# Altium schematic sheet LazeMEGA.SchDoc
size A4
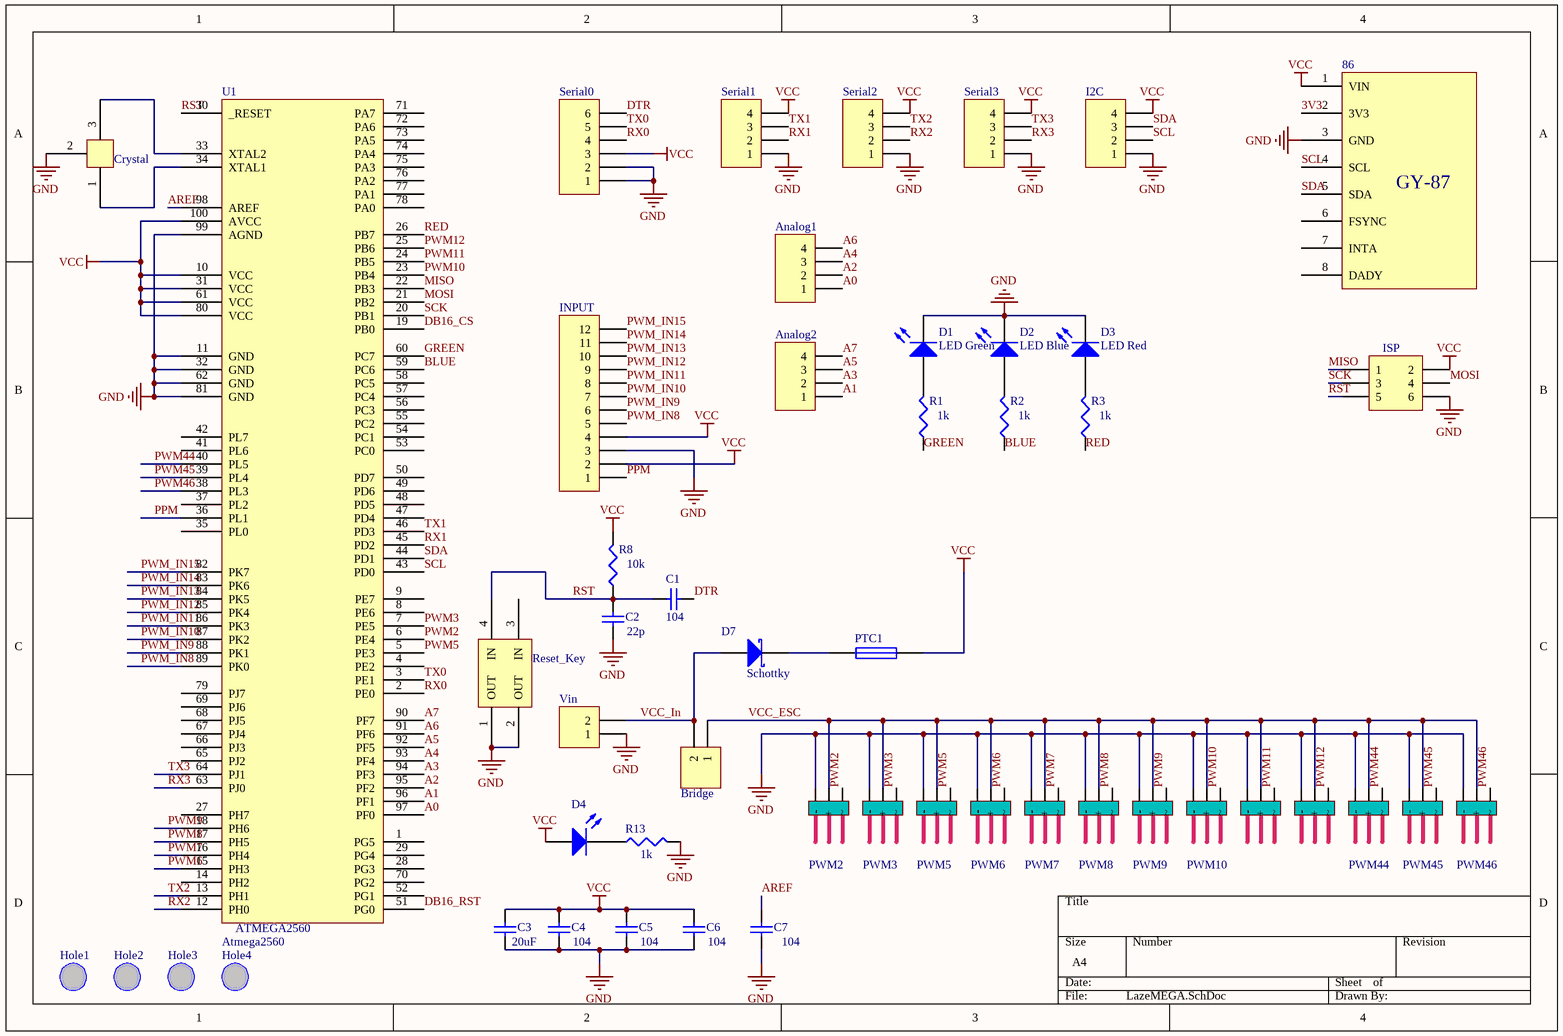
[diagram p0: LazeMEGA.SchDoc]

## Parts
86  (no value)  [GY-87]
Analog1  Header 4  [HDR1X4]  (value not drawn)
Analog2  Header 4  [HDR1X4]  (value not drawn)
Bridge  Header 2  [HDR1X2]  (value not drawn)
C1  104  [CAPC1608L]
C2  22p  [CAPC1608L]
C3  20uF  [CAPC3216L]
C4  104  [CAPC1608L]
C5  104  [CAPC1608L]
C6  104  [CAPC1608L]
C7  104  [CAPC1608L]
Crystal  Crystal 16M  [Crystal3Foot]  (value not drawn)
D1  LED Green  [CAPC2012L]
D2  LED Blue  [CAPC2012L]
D3  LED Red  [CAPC2012L]
D4  LED Red  [CAPC2012L]  (value not drawn)
D7  Schottky  [CAPC3216L]
Hole1  3mmHole  [3mmHoleSmall]  (value not drawn)
Hole2  3mmHole  [3mmHoleSmall]  (value not drawn)
Hole3  3mmHole  [3mmHoleSmall]  (value not drawn)
Hole4  3mmHole  [3mmHoleSmall]  (value not drawn)
I2C  Header 4  [HDR1X4]  (value not drawn)
INPUT  Header 12  [HDR1X12]  (value not drawn)
ISP  Header 3X2  [HDR2X3]  (value not drawn)
JP1  Servo out 1  [JP]  (value not drawn)
JP2  Servo out 1  [JP]  (value not drawn)
PTC1  Fuse  [CAPC3216L]  (value not drawn)
PWM2  Servo out 1  [JP]  (value not drawn)
PWM3  Servo out 1  [JP]  (value not drawn)
PWM5  Servo out 1  [JP]  (value not drawn)
PWM6  Servo out 1  [JP]  (value not drawn)
PWM7  Servo out 1  [JP]  (value not drawn)
PWM8  Servo out 1  [JP]  (value not drawn)
PWM9  Servo out 1  [JP]  (value not drawn)
PWM10  Servo out 1  [JP]  (value not drawn)
PWM44  Servo out 1  [JP]  (value not drawn)
PWM45  Servo out 1  [JP]  (value not drawn)
PWM46  Servo out 1  [JP]  (value not drawn)
R1  1k  [RESC1608L]
R2  1k  [RESC1608L]
R3  1k  [RESC1608L]
R8  10k  [RESC1608L]
R13  1k  [RESC1608L]
Reset_Key  Key  [Key]  (value not drawn)
Serial0  Header 6  [HDR1X6]  (value not drawn)
Serial1  Header 4  [HDR1X4]  (value not drawn)
Serial2  Header 4  [HDR1X4]  (value not drawn)
Serial3  Header 4  [HDR1X4]  (value not drawn)
U1  Atmega2560  [ATMEGA2560]
Vin  Header 2  [HDR1X2]  (value not drawn)

## Nets
GND: 86.3(GND) C2.2 C3.1 C4.1 C5.1 C6.1 C7.1 Crystal.2 D1.2(K) D2.2(K) D3.2(K) I2C.1 INPUT.3 ISP.6 JP1.3(-) JP2.3(-) PWM2.3(-) PWM3.3(-) PWM5.3(-) PWM6.3(-) PWM7.3(-) PWM8.3(-) PWM9.3(-) PWM10.3(-) PWM44.3(-) PWM45.3(-) PWM46.3(-) R13.2 Reset_Key.1(OUT) Reset_Key.2(OUT) Serial0.1 Serial0.2 Serial1.1 Serial2.1 Serial3.1 U1.11(GND) U1.32(GND) U1.62(GND) U1.81(GND) U1.99(AGND) Vin.1
VCC: 86.1(VIN) C3.2 C4.2 C5.2 C6.2 D4.1(A) I2C.4 INPUT.2 INPUT.4 ISP.2 PTC1.2 R8.2 Serial0.3 Serial1.4 Serial2.4 Serial3.4 U1.10(VCC) U1.31(VCC) U1.61(VCC) U1.80(VCC) U1.100(AVCC)
3V3: 86.2(3V3)
A0: Analog1.1 U1.97(PF0)
A1: Analog2.1 U1.96(PF1)
A2: Analog1.2 U1.95(PF2)
A3: Analog2.2 U1.94(PF3)
A4: Analog1.3 U1.93(PF4)
A5: Analog2.3 U1.92(PF5)
A6: Analog1.4 U1.91(PF6)
A7: Analog2.4 U1.90(PF7)
AREF: C7.2 U1.98(AREF)
BLUE: R2.1 U1.59(PC6)
DB16_CS: U1.19(PB0)
DB16_RST: U1.51(PG0)
DTR: C1.2 Serial0.6
GREEN: R1.1 U1.60(PC7)
MISO: ISP.1 U1.22(PB3)
MOSI: ISP.4 U1.21(PB2)
PPM: INPUT.1 U1.36(PL1)
PWM2: PWM2.1 U1.6(PE4)
PWM3: PWM3.1 U1.7(PE5)
PWM5: PWM5.1 U1.5(PE3)
PWM6: PWM6.1 U1.15(PH3)
PWM7: PWM7.1 U1.16(PH4)
PWM8: PWM8.1 U1.17(PH5)
PWM9: PWM9.1 U1.18(PH6)
PWM10: PWM10.1 U1.23(PB4)
PWM11: JP1.1 U1.24(PB5)
PWM12: JP2.1 U1.25(PB6)
PWM44: PWM44.1 U1.40(PL5)
PWM45: PWM45.1 U1.39(PL4)
PWM46: PWM46.1 U1.38(PL3)
PWM_IN8: INPUT.5 U1.89(PK0)
PWM_IN9: INPUT.6 U1.88(PK1)
PWM_IN10: INPUT.7 U1.87(PK2)
PWM_IN11: INPUT.8 U1.86(PK3)
PWM_IN12: INPUT.9 U1.85(PK4)
PWM_IN13: INPUT.10 U1.84(PK5)
PWM_IN14: INPUT.11 U1.83(PK6)
PWM_IN15: INPUT.12 U1.82(PK7)
RED: R3.1 U1.26(PB7)
RST: C1.1 C2.1 ISP.5 R8.1 Reset_Key.4(IN) U1.30(_RESET)
RX0: Serial0.4 U1.2(PE0)
RX1: Serial1.2 U1.45(PD2)
RX2: Serial2.2 U1.12(PH0)
RX3: Serial3.2 U1.63(PJ0)
SCK: ISP.3 U1.20(PB1)
SCL: 86.4(SCL) I2C.2 U1.43(PD0)
SDA: 86.5(SDA) I2C.3 U1.44(PD1)
TX0: Serial0.5 U1.3(PE1)
TX1: Serial1.3 U1.46(PD3)
TX2: Serial2.3 U1.13(PH1)
TX3: Serial3.3 U1.64(PJ1)
VCC_ESC: Bridge.1 JP1.2(+) JP2.2(+) PWM2.2(+) PWM3.2(+) PWM5.2(+) PWM6.2(+) PWM7.2(+) PWM8.2(+) PWM9.2(+) PWM10.2(+) PWM44.2(+) PWM45.2(+) PWM46.2(+)
VCC_In: Bridge.2 D7.1(A) Vin.2
NetCrystal_1: Crystal.1 U1.34(XTAL1)
NetCrystal_3: Crystal.3 U1.33(XTAL2)
NetD1_1: D1.1(A) R1.2
NetD2_1: D2.1(A) R2.2
NetD3_1: D3.1(A) R3.2
NetD4_2: D4.2(K) R13.1
NetD7_2: D7.2(K) PTC1.1

Not connected (* = marked no-connect by the designer): 86 6(FSYNC) 7(INTA) 8(DADY); Reset_Key 3(IN); U1 1(PG5) 4(PE2) 8(PE6) 9(PE7) 14(PH2) 27(PH7) 28(PG3) 29(PG4) 35(PL0) 37(PL2) 41(PL6) 42(PL7) 47(PD4) 48(PD5) 49(PD6) 50(PD7) 52(PG1) 53(PC0) 54(PC1) 55(PC2) 56(PC3) 57(PC4) 58(PC5) 65(PJ2) 66(PJ3) 67(PJ4) 68(PJ5) 69(PJ6) 70(PG2) 71(PA7) 72(PA6) 73(PA5) 74(PA4) 75(PA3) 76(PA2) 77(PA1) 78(PA0) 79(PJ7)

## Notes on the sheet
- (in symbol Atmega2560) ATMEGA2560

## Library data of the parts
86 = GY-87
Analog1 Analog2 I2C Serial1-Serial3 = Header 4: Header, 4-Pin; LatestRevisionDate: 17-Jul-2002; LatestRevisionNote: Re-released for DXP Platform.; Publisher: Altium Limited
Bridge Vin = Header 2: Header, 2-Pin; LatestRevisionDate: 17-Jul-2002; LatestRevisionNote: Re-released for DXP Platform.; Publisher: Altium Limited
C1 C4-C7 = Cap Semi: Capacitor (Semiconductor SIM Model); Value: 0.1uF; Published: 8-Jun-2000; LatestRevisionDate: 29-May-2009; LatestRevisionNote: IPC-7351 Footprint Added.; PackageReference: C1206; Publisher: Altium Limited; PackageDescription: Chip Capacitor
C2 C3 = Cap Semi: Capacitor (Semiconductor SIM Model); Published: 8-Jun-2000; LatestRevisionDate: 29-May-2009; LatestRevisionNote: IPC-7351 Footprint Added.; PackageReference: C1206; Publisher: Altium Limited; PackageDescription: Chip Capacitor
  C2: Value: 22p
  C3: Value: 20uF
Crystal = Crystal3Foot
D1-D4 = LED2: Typical RED, GREEN, YELLOW, AMBER GaAs LED; Published: 8-Jun-2000; LatestRevisionDate: 17-Jul-2002; LatestRevisionNote: Re-released for DXP Platform.; PackageVersion: Feb-2002; PackageReference: 3.2X1.6X1.1; Publisher: Altium Limited
D7 = D Schottky: Schottky Diode; Published: 8-Jun-2000; LatestRevisionDate: 17-Jul-2002; LatestRevisionNote: Re-released for DXP Platform.; PackageReference: SMB; Publisher: Altium Limited; Code_JEDEC: DO-214-AA
INPUT = Header 12: Header, 12-Pin; LatestRevisionDate: 17-Jul-2002; LatestRevisionNote: Re-released for DXP Platform.; Publisher: Altium Limited
ISP = Header 3X2: Header, 3-Pin, Dual row; LatestRevisionDate: 17-Jul-2002; LatestRevisionNote: Re-released for DXP Platform.; Publisher: Altium Limited
JP1 JP2 PWM2 PWM3 PWM5-PWM10 PWM44-PWM46 = Hdr 3 Pin 0.1: Header, 3-Pin, 0.1"; Manufacturer: Generic Components; Class: Connector; Supplier 1: Digi-Key; Supplier Part Number 1: MTLW-103-23-S-S-260-ND
PTC1 = Fuse 1: Published: 8-Jun-2000; LatestRevisionDate: 17-Jul-2002; LatestRevisionNote: Re-released for DXP Platform.; PackageReference: PIN-W2/E2.8; Publisher: Altium Limited
R1-R3 R8 R13 = Res3: Resistor; Published: 8-Jun-2000; LatestRevisionDate: 29-May-2009; LatestRevisionNote: IPC-7351 Footprint Added.; PackageReference: J1-0603; Publisher: Altium Limited; PackageDescription: Chip Resistor
  R1-R3 R13: Value: 1k
  R8: Value: 10k
Serial0 = Header 6: Header, 6-Pin; LatestRevisionDate: 17-Jul-2002; LatestRevisionNote: Re-released for DXP Platform.; Publisher: Altium Limited